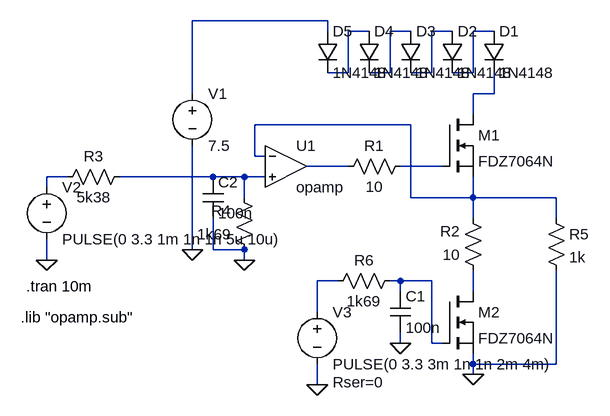
[diagram p0: schematic Laser driver shutdown.asc]
Laser driver shutdown.asc, the LTspice schematic file:
Version 4
SHEET 1 880 680
WIRE 128 -64 -80 -64
WIRE 128 -48 128 -64
WIRE 192 -48 160 -48
WIRE 256 -48 224 -48
WIRE 320 -48 288 -48
WIRE 384 -48 352 -48
WIRE 160 16 160 -48
WIRE 160 16 128 16
WIRE 224 16 224 -48
WIRE 224 16 192 16
WIRE 288 16 288 -48
WIRE 288 16 256 16
WIRE 352 16 352 -48
WIRE 352 16 320 16
WIRE -80 48 -80 -64
WIRE 384 48 384 16
WIRE 384 48 352 48
WIRE 352 80 352 48
WIRE 256 96 16 96
WIRE 16 144 16 96
WIRE 32 144 16 144
WIRE 160 160 96 160
WIRE 304 160 240 160
WIRE -272 176 -304 176
WIRE -48 176 -192 176
WIRE 0 176 -48 176
WIRE 32 176 0 176
WIRE -304 192 -304 176
WIRE 0 208 0 176
WIRE 256 208 256 96
WIRE 352 208 352 176
WIRE 352 208 256 208
WIRE 480 208 352 208
WIRE 352 240 352 208
WIRE 480 240 480 208
WIRE -80 288 -80 128
WIRE -48 288 -48 240
WIRE 0 288 -48 288
WIRE -304 304 -304 272
WIRE 0 304 0 288
WIRE 144 336 112 336
WIRE 240 336 224 336
WIRE 288 336 240 336
WIRE 240 352 240 336
WIRE 352 352 352 320
WIRE 112 384 112 336
WIRE 240 432 240 416
WIRE 288 432 288 336
WIRE 304 432 288 432
WIRE 352 464 352 448
WIRE 480 464 480 320
WIRE 480 464 352 464
WIRE 352 480 352 464
WIRE 112 496 112 464
FLAG 352 480 0
FLAG -80 288 0
FLAG 0 304 0
FLAG -304 304 0
FLAG 112 496 0
FLAG 240 432 0
SYMBOL nmos 304 80 R0
SYMATTR InstName M1
SYMATTR Value FDZ7064N
SYMBOL voltage -80 32 R0
WINDOW 123 0 0 Left 2
WINDOW 39 0 0 Left 2
SYMATTR InstName V1
SYMATTR Value 7.5
SYMBOL Opamps\\opamp 64 96 R0
SYMATTR InstName U1
SYMATTR SpiceLine2 GBW=500k
SYMBOL res 256 144 R90
WINDOW 0 0 56 VBottom 2
WINDOW 3 32 56 VTop 2
SYMATTR InstName R1
SYMATTR Value 10
SYMBOL res 368 336 R180
WINDOW 0 36 76 Left 2
WINDOW 3 36 40 Left 2
SYMATTR InstName R2
SYMATTR Value 10
SYMBOL diode 368 -48 R0
SYMATTR InstName D1
SYMATTR Value 1N4148
SYMBOL diode 304 -48 R0
SYMATTR InstName D2
SYMATTR Value 1N4148
SYMBOL diode 240 -48 R0
SYMATTR InstName D3
SYMATTR Value 1N4148
SYMBOL diode 176 -48 R0
SYMATTR InstName D4
SYMATTR Value 1N4148
SYMBOL diode 112 -48 R0
SYMATTR InstName D5
SYMATTR Value 1N4148
SYMBOL res -176 160 R90
WINDOW 0 0 56 VBottom 2
WINDOW 3 32 56 VTop 2
SYMATTR InstName R3
SYMATTR Value 5k38
SYMBOL res 16 304 R180
WINDOW 0 36 76 Left 2
WINDOW 3 36 40 Left 2
SYMATTR InstName R4
SYMATTR Value 1k69
SYMBOL voltage -304 176 R0
WINDOW 123 0 0 Left 2
WINDOW 39 0 0 Left 2
SYMATTR InstName V2
SYMATTR Value PULSE(0 3.3 1m 1n 1n 5u 10u)
SYMBOL nmos 304 352 R0
SYMATTR InstName M2
SYMATTR Value FDZ7064N
SYMBOL res 464 224 R0
SYMATTR InstName R5
SYMATTR Value 1k
SYMBOL voltage 112 368 R0
WINDOW 123 0 0 Left 2
WINDOW 39 24 124 Left 2
SYMATTR SpiceLine Rser=0
SYMATTR InstName V3
SYMATTR Value PULSE(0 3.3 3m 1n 1n 2m 4m)
SYMBOL res 240 320 R90
WINDOW 0 0 56 VBottom 2
WINDOW 3 32 56 VTop 2
SYMATTR InstName R6
SYMATTR Value 1k69
SYMBOL cap 224 352 R0
SYMATTR InstName C1
SYMATTR Value 100n
SYMBOL cap -64 176 R0
SYMATTR InstName C2
SYMATTR Value 100n
TEXT -336 344 Left 2 !.tran 10m
TEXT -344 392 Left 2 !.lib "opamp.sub"

The netlist it stands for:
* Laser driver shutdown.asc
M1 N006 N009 N007 N007 FDZ7064N
V1 N001 0 7.5
XU1 N007 N011 N008 opamp Aol=100K GBW=500k  ; pins invin noninvin out
R1 N009 N008 10
R2 N014 N007 10
D1 N005 N006 1N4148
D2 N004 N005 1N4148
D3 N003 N004 1N4148
D4 N002 N003 1N4148
D5 N001 N002 1N4148
R3 N011 N010 5k38
R4 0 N011 1k69
V2 N010 0 PULSE(0 3.3 1m 1n 1n 5u 10u)
M2 N014 N013 0 0 FDZ7064N
R5 N007 0 1k
V3 N012 0 PULSE(0 3.3 3m 1n 1n 2m 4m) Rser=0
R6 N013 N012 1k69
C1 N013 0 100n
C2 N011 0 100n
.model D D
.lib standard.dio
.model NMOS NMOS
.model PMOS PMOS
.lib standard.mos
.tran 10m
.lib "opamp.sub"
.backanno
.end